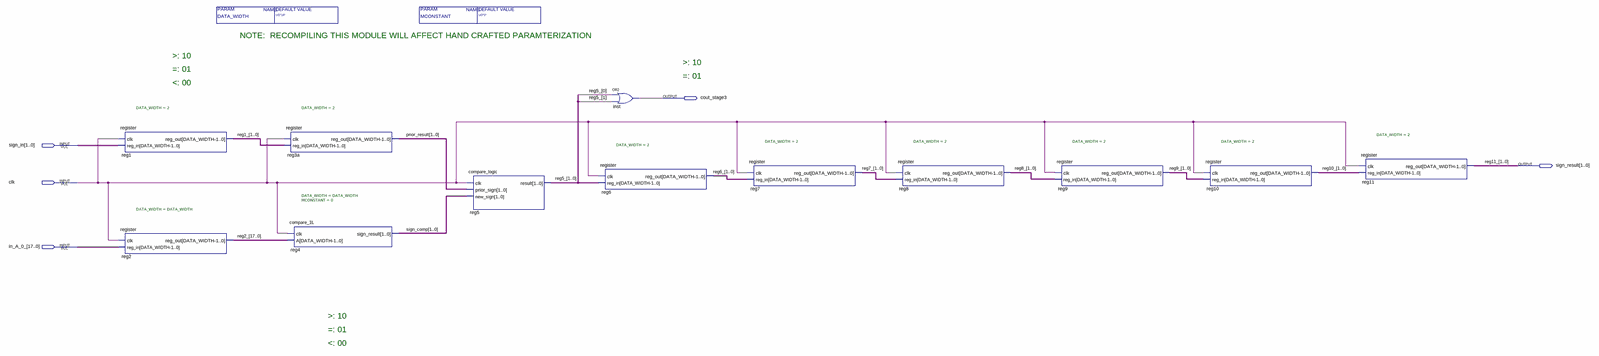
[diagram p0: schematic sheet, whole]
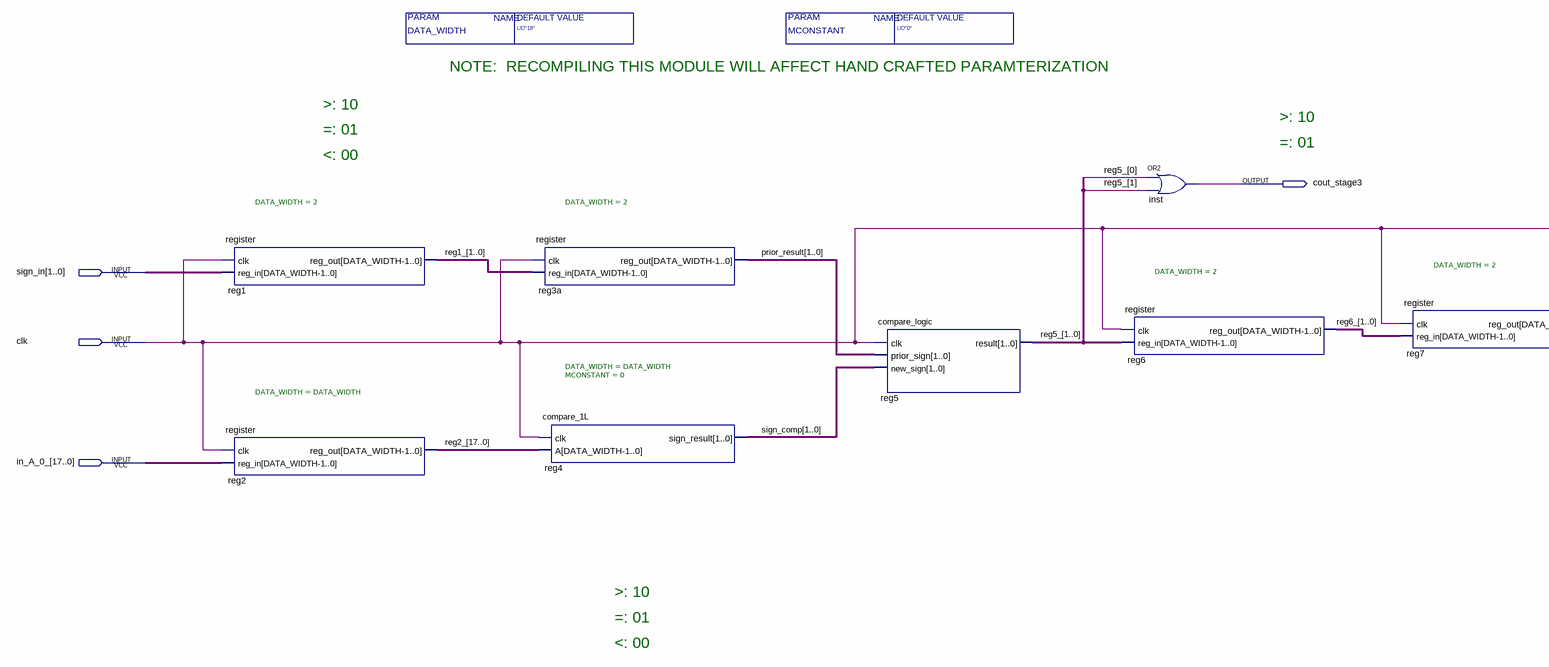
[diagram p1: schematic sheet, left part]
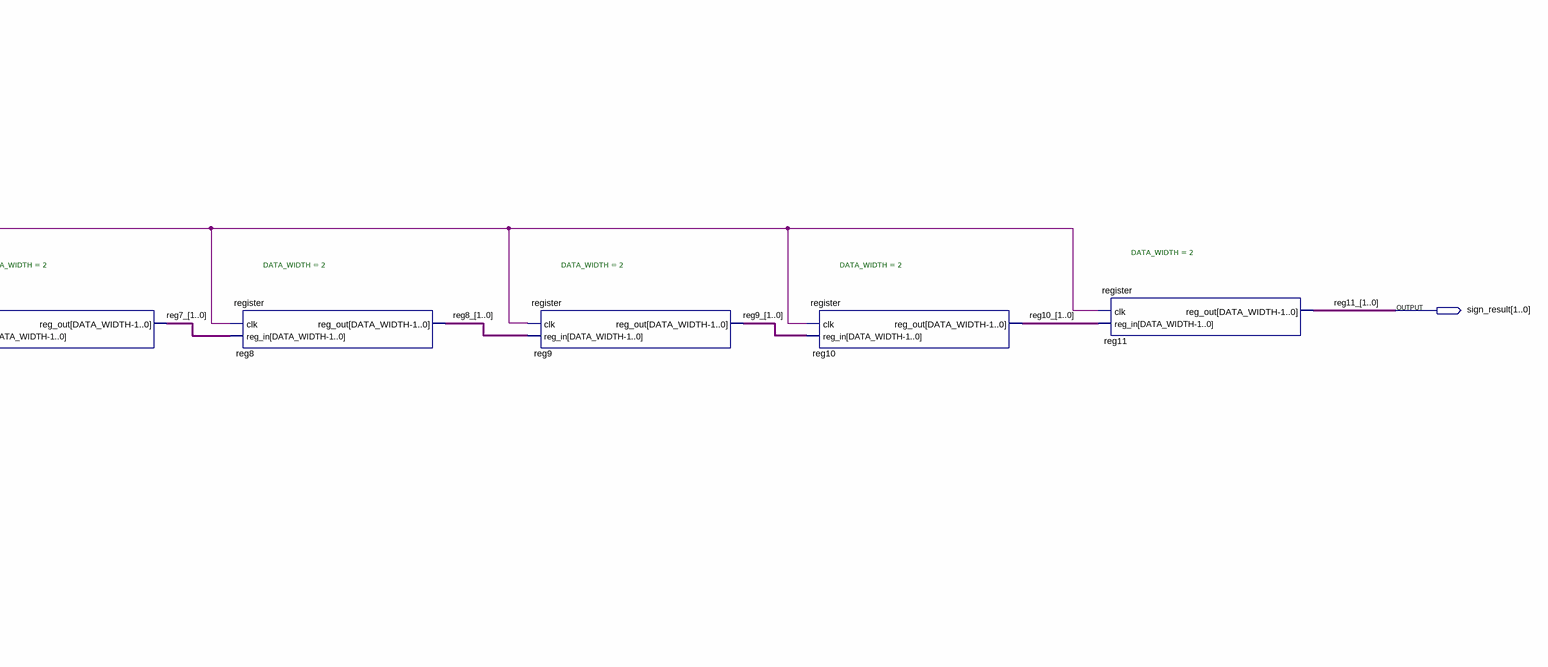
[diagram p2: schematic sheet, right part]
// Quartus schematic ModCompare_9L_mlab.bdf as structural Verilog: 12 symbols, 5 pins
module ModCompare_9L_mlab #(parameter DATA_WIDTH = "UD\"18\"", parameter MCONSTANT = "UD\"0\"") (
  input  [1:0] sign_in,
  input  clk,
  input  [17:0] in_A_0_,
  output cout_stage3,
  output [1:0] sign_result
);

  wire [1:0] prior_result, reg1_, reg5_, reg6_, reg7_, reg8_, reg9_, reg10_, sign_comp;
  wire [17:0] reg2_;

  register #(.DATA_WIDTH(2)) reg1 (.clk(clk), .reg_in(sign_in), .reg_out(reg1_));
  register #(.DATA_WIDTH(DATA_WIDTH)) reg2 (.clk(clk), .reg_in(in_A_0_), .reg_out(reg2_));
  register #(.DATA_WIDTH(2)) reg3a (.clk(clk), .reg_in(reg1_), .reg_out(prior_result));
  compare_1L #(.DATA_WIDTH(DATA_WIDTH), .MCONSTANT(0)) reg4 (.clk(clk), .A(reg2_), .sign_result(sign_comp));
  compare_logic reg5 (.clk(clk), .prior_sign(prior_result), .new_sign(sign_comp), .result(reg5_));
  or inst (cout_stage3, reg5_[0], reg5_[1]);
  register #(.DATA_WIDTH(2)) reg6 (.clk(clk), .reg_in(reg5_), .reg_out(reg6_));
  register #(.DATA_WIDTH(2)) reg7 (.clk(clk), .reg_in(reg6_), .reg_out(reg7_));
  register #(.DATA_WIDTH(2)) reg8 (.clk(clk), .reg_in(reg7_), .reg_out(reg8_));
  register #(.DATA_WIDTH(2)) reg9 (.clk(clk), .reg_in(reg8_), .reg_out(reg9_));
  register #(.DATA_WIDTH(2)) reg10 (.clk(clk), .reg_in(reg9_), .reg_out(reg10_));
  register #(.DATA_WIDTH(2)) reg11 (.clk(clk), .reg_in(reg10_), .reg_out(sign_result));

  // Other names for the same wires on the sheet: reg11_[1:0] = sign_result

  // Notes on the sheet:
  //   NOTE:  RECOMPILING THIS MODULE WILL AFFECT HAND CRAFTED PARAMTERIZATION
  //   >: 10
  //   >: 10
  //   =: 01
  //   =: 01
  //   <: 00
  //   >: 10
  //   =: 01
  //   <: 00
endmodule
